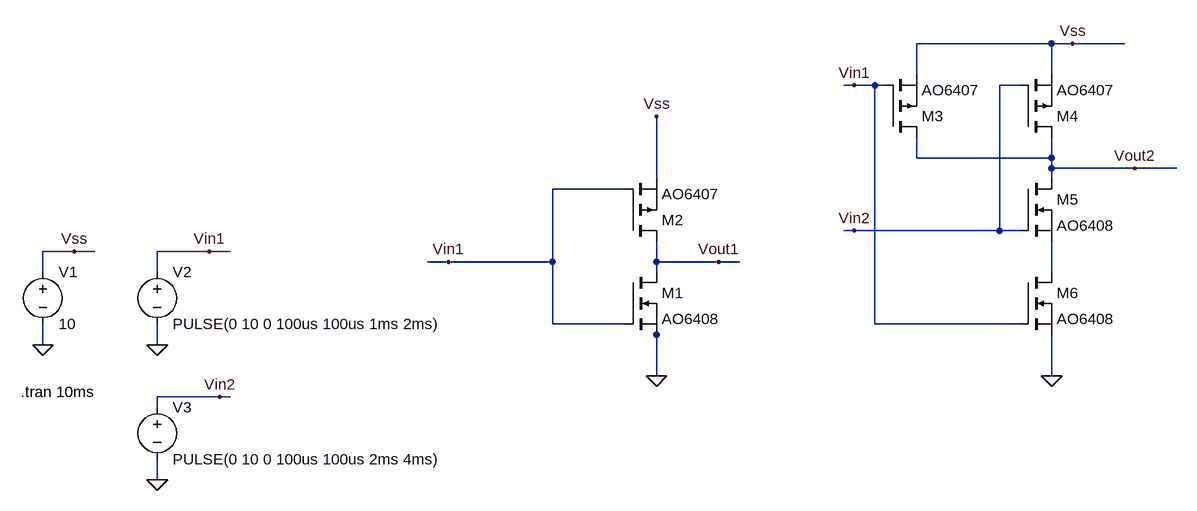
[diagram p0: schematic Gates.asc]
Gates.asc, the LTspice schematic file:
Version 4
SHEET 1 1060 680
WIRE 864 -176 656 -176
WIRE 896 -176 864 -176
WIRE 976 -176 896 -176
WIRE 656 -128 656 -176
WIRE 864 -128 864 -176
WIRE 560 -112 544 -112
WIRE 592 -112 560 -112
WIRE 608 -112 592 -112
WIRE 816 -112 784 -112
WIRE 656 0 656 -32
WIRE 864 0 864 -32
WIRE 864 0 656 0
WIRE 864 16 864 0
WIRE 992 16 864 16
WIRE 1056 16 992 16
WIRE 256 32 256 -64
WIRE 864 32 864 16
WIRE 208 48 96 48
WIRE 560 112 544 112
WIRE 784 112 784 -112
WIRE 784 112 560 112
WIRE 816 112 784 112
WIRE -640 144 -688 144
WIRE -608 144 -640 144
WIRE -432 144 -512 144
WIRE -400 144 -432 144
WIRE -64 160 -96 160
WIRE 96 160 96 48
WIRE 96 160 -64 160
WIRE 256 160 256 128
WIRE 352 160 256 160
WIRE 384 160 352 160
WIRE -688 176 -688 144
WIRE -512 176 -512 144
WIRE 256 176 256 160
WIRE 864 176 864 128
WIRE 96 256 96 160
WIRE 208 256 96 256
WIRE 592 256 592 -112
WIRE 816 256 592 256
WIRE 256 272 256 256
WIRE -688 288 -688 256
WIRE -512 288 -512 256
WIRE 256 336 256 272
WIRE 864 336 864 272
WIRE -416 368 -512 368
WIRE -400 368 -416 368
WIRE -512 384 -512 368
WIRE -512 496 -512 464
FLAG 256 336 0
FLAG 256 -64 Vss
FLAG -64 160 Vin1
FLAG -432 144 Vin1
FLAG -640 144 Vss
FLAG -688 288 0
FLAG -512 288 0
FLAG 352 160 Vout1
FLAG -512 496 0
FLAG -416 368 Vin2
FLAG 864 336 0
FLAG 896 -176 Vss
FLAG 560 -112 Vin1
FLAG 560 112 Vin2
FLAG 992 16 Vout2
SYMBOL pmos 208 128 M180
SYMATTR InstName M2
SYMATTR Value AO6407
SYMBOL voltage -688 160 R0
WINDOW 123 0 0 Left 0
WINDOW 39 0 0 Left 0
SYMATTR InstName V1
SYMATTR Value 10
SYMBOL voltage -512 160 R0
WINDOW 123 0 0 Left 0
WINDOW 39 0 0 Left 0
SYMATTR InstName V2
SYMATTR Value PULSE(0 10 0 100us 100us 1ms 2ms)
SYMBOL nmos 208 176 R0
SYMATTR InstName M1
SYMATTR Value AO6408
SYMBOL voltage -512 368 R0
WINDOW 123 0 0 Left 0
WINDOW 39 0 0 Left 0
SYMATTR InstName V3
SYMATTR Value PULSE(0 10 0 100us 100us 2ms 4ms)
SYMBOL pmos 608 -32 M180
SYMATTR InstName M3
SYMATTR Value AO6407
SYMBOL pmos 816 -32 M180
SYMATTR InstName M4
SYMATTR Value AO6407
SYMBOL nmos 816 32 R0
SYMATTR InstName M5
SYMATTR Value AO6408
SYMBOL nmos 816 176 R0
SYMATTR InstName M6
SYMATTR Value AO6408
TEXT -722 360 Left 2 !.tran 10ms

The netlist it stands for:
* Gates.asc
M2 Vout1 Vin1 Vss Vss AO6407
V1 Vss 0 10
V2 Vin1 0 PULSE(0 10 0 100us 100us 1ms 2ms)
M1 Vout1 Vin1 0 0 AO6408
V3 Vin2 0 PULSE(0 10 0 100us 100us 2ms 4ms)
M3 Vout2 Vin1 Vss Vss AO6407
M4 Vout2 Vin2 Vss Vss AO6407
M5 Vout2 Vin2 N001 N001 AO6408
M6 N001 Vin1 0 0 AO6408
.model NMOS NMOS
.model PMOS PMOS
.lib standard.mos
.tran 10ms
.backanno
.end